# EAGLE design main controler (EAGLE 9.5.2)
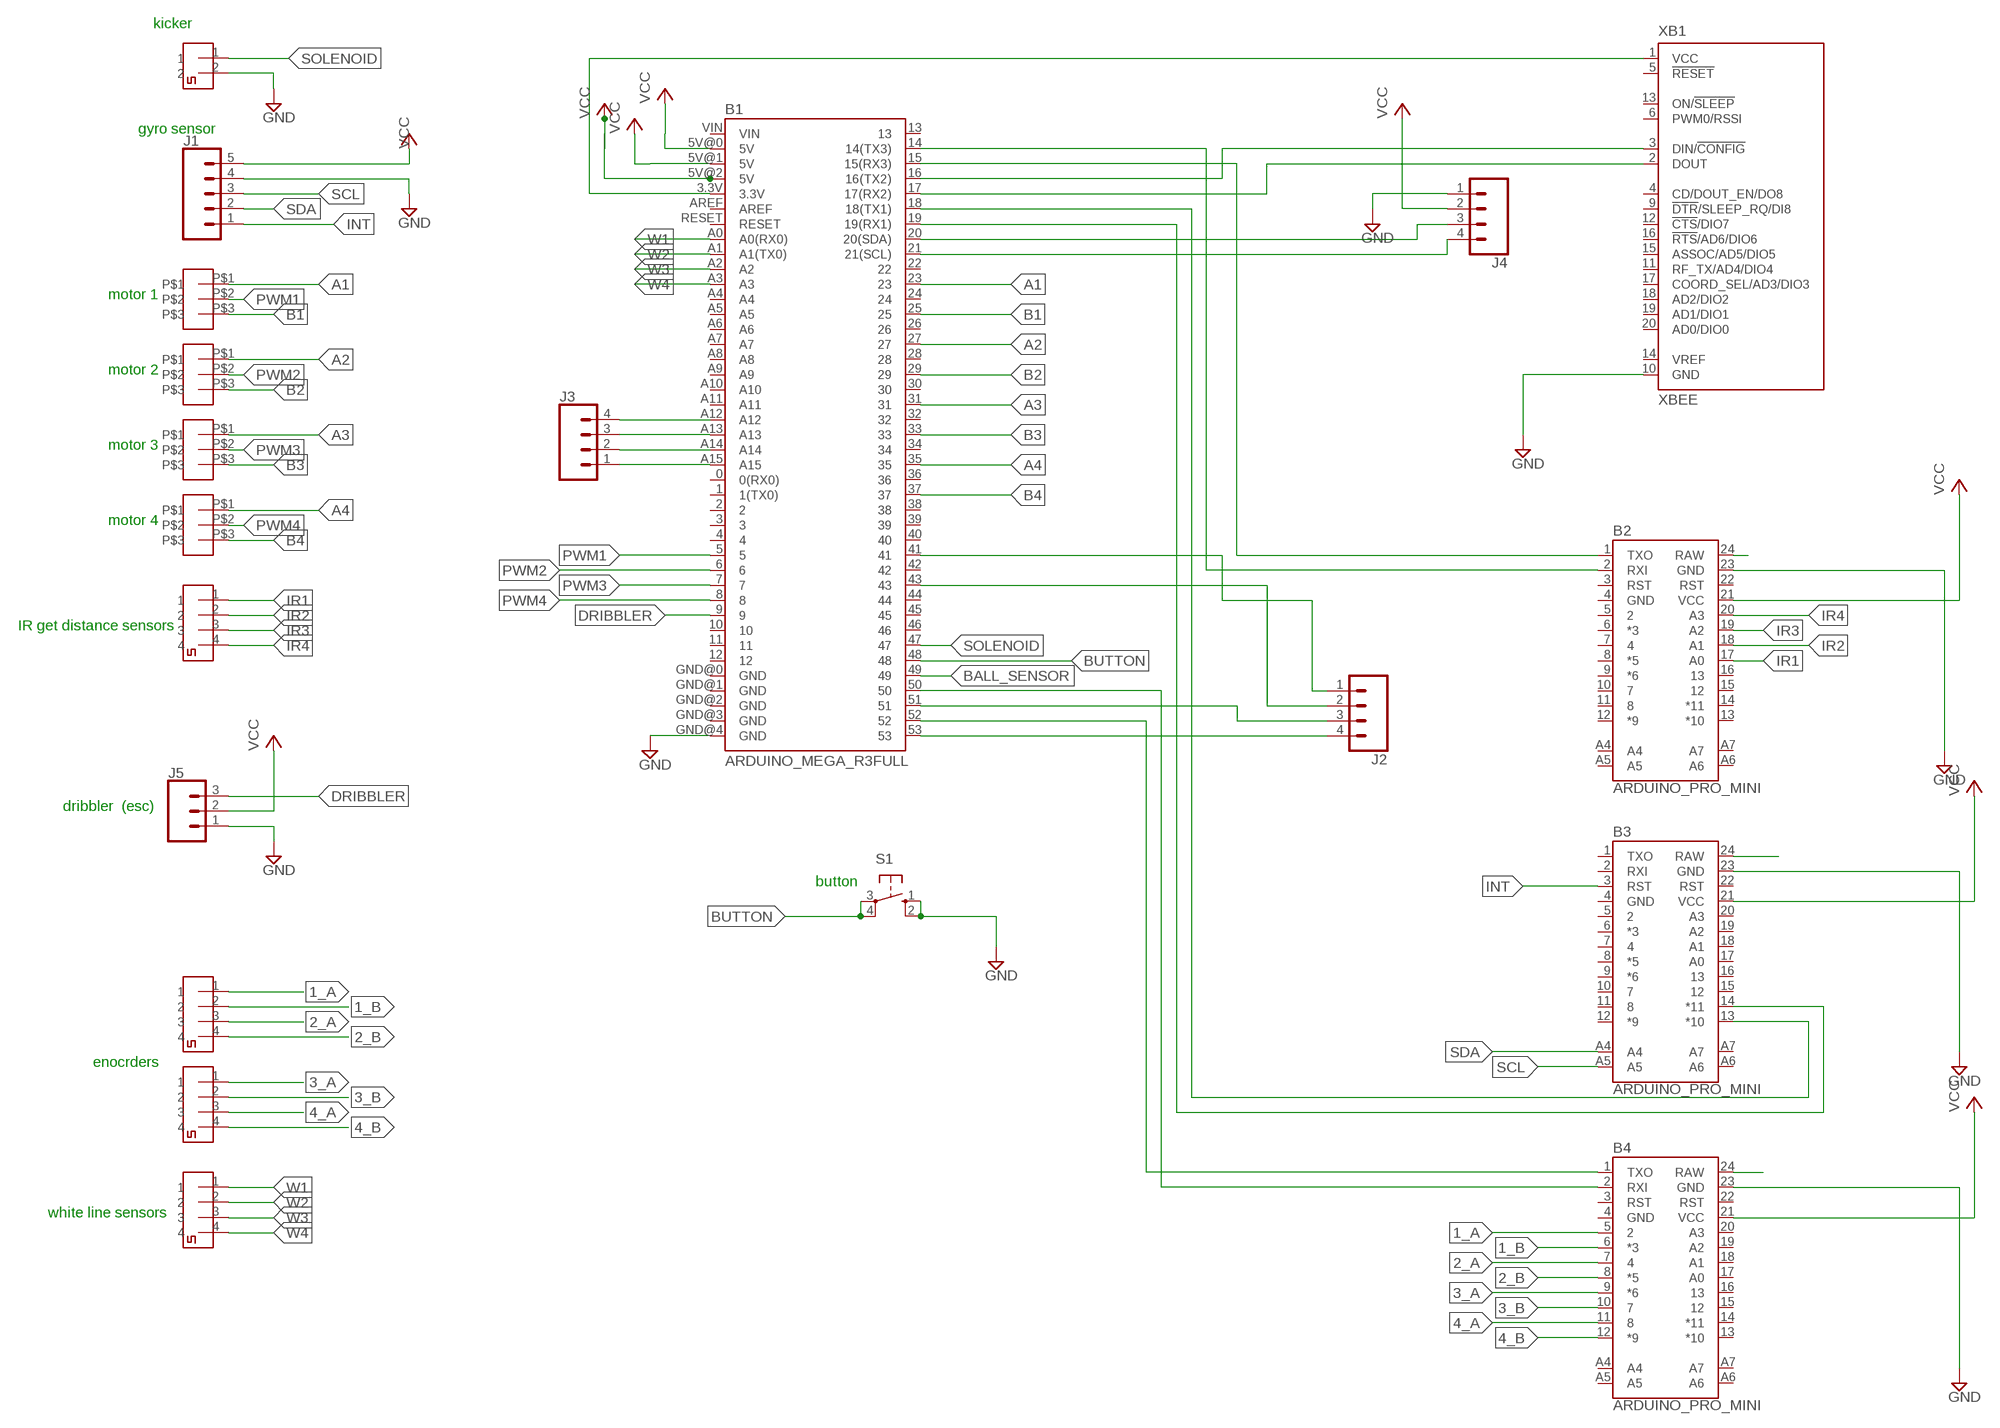
[diagram p0: schematic, sheet 1]

## Parts
B1  ARDUINO_MEGA_R3FULL  [ARDUINO_MEGA]
B2  ARDUINO_PRO_MINI  [ARDUINO_PRO_MINI]
B3  ARDUINO_PRO_MINI  [ARDUINO_PRO_MINI]
B4  ARDUINO_PRO_MINI  [ARDUINO_PRO_MINI]
CONNECTOR1  2PIN  [2PIN]
ENCODER1  2PIN  [2PIN]
ENCODER2  2PIN  [2PIN]
ENCODER3  2PIN  [2PIN]
ENCODER4  2PIN  [2PIN]
J1  CONN_05  [1X05]
J2  CONN_04  [1X04]
J3  CONN_04  [1X04]
J4  CONN_04  [1X04]
J5  CONN_03  [1X03]
MOTOR1  3PIN  [3PIN]
MOTOR2  3PIN  [3PIN]
MOTOR3  3PIN  [3PIN]
MOTOR4  3PIN  [3PIN]
S1  10-XX  [B3F-10XX]
XB1  XBEE  [XBEE]

## Nets
1_A: B4.5 ENCODER2.1
1_B: B4.6(*3) ENCODER2.2
2_A: B4.7 ENCODER2.3
2_B: B4.8(*5) ENCODER2.4
3_A: B4.9(*6) ENCODER1.1
3_B: B4.10 ENCODER1.2
4_A: B4.11 ENCODER1.3
4_B: B4.12(*9) ENCODER1.4
A1: B1.23 MOTOR1.P$1
A2: B1.27 MOTOR2.P$1
A3: B1.31 MOTOR3.P$1
A4: B1.35 MOTOR4.P$1
B1: B1.25 MOTOR1.P$3
B2: B1.29 MOTOR2.P$3
B3: B1.33 MOTOR3.P$3
B4: B1.37 MOTOR4.P$3
BALL_SENSOR: B1.49
BUTTON: B1.48 S1.3(P) S1.4(P1)
DRIBBLER: B1.9 J5.3
GND: B1.GND@4(GND) B2.23(GND) B3.23(GND) B4.23(GND) CONNECTOR1.2 J1.4 J4.1 J5.1 S1.1(S) S1.2(S1) XB1.10(GND)
INT: B3.3(RST) J1.1
IR1: B2.17(A0) ENCODER4.1
IR2: B2.18(A1) ENCODER4.2
IR3: B2.19(A2) ENCODER4.3
IR4: B2.20(A3) ENCODER4.4
N$1: B1.3.3V XB1.1(VCC)
N$2: B1.16(16(TX2)) XB1.3(DIN/!CONFIG)
N$3: B1.15(15(RX3)) B2.1(TXO)
N$4: B1.14(14(TX3)) B2.2(RXI)
N$5: B1.17(17(RX2)) XB1.2(DOUT)
N$6: B1.19(19(RX1)) B3.14(*11)
N$7: B1.18(18(TX1)) B3.13(*10)
N$8: B1.50 B4.2(RXI)
N$9: B1.52 B4.1(TXO)
N$10: B2.24(RAW)
N$11: B3.24(RAW)
N$12: B4.24(RAW)
N$13: B1.43 J2.2
N$14: B1.51 J2.3
N$15: B1.53 J2.4
N$16: B1.41 J2.1
N$17: B1.A15 J3.1
N$18: B1.A14 J3.2
N$19: B1.A13 J3.3
N$20: B1.A12 J3.4
N$22: B1.21(21(SCL)) J4.4
N$23: B1.20(20(SDA)) J4.3
PWM1: B1.5 MOTOR1.P$2
PWM2: B1.6 MOTOR2.P$2
PWM3: B1.7 MOTOR3.P$2
PWM4: B1.8 MOTOR4.P$2
SCL: B3.A5 J1.3
SDA: B3.A4 J1.2
SOLENOID: B1.47 CONNECTOR1.1
VCC: B1.5V@0(5V) B1.5V@1(5V) B1.5V@2(5V) B2.21(VCC) B3.21(VCC) B4.21(VCC) J1.5 J4.2 J5.2
W1: B1.A0(A0(RX0)) ENCODER3.1
W2: B1.A1(A1(TX0)) ENCODER3.2
W3: B1.A2 ENCODER3.3
W4: B1.A3 ENCODER3.4
Unconnected: B1.0(0(RX0)) B1.1(1(TX0)) B1.2 B1.3 B1.4 B1.10 B1.11 B1.12 B1.13 B1.22 B1.24 B1.26 B1.28 B1.30 B1.32 B1.34 B1.36 B1.38 B1.39 B1.40 B1.42 B1.44 B1.45 B1.46 B1.A4 B1.A5 B1.A6 B1.A7 B1.A8 B1.A9 B1.A10 B1.A11 B1.AREF B1.GND@0(GND) B1.GND@1(GND) B1.GND@2(GND) B1.GND@3(GND) B1.RESET B1.VIN B2.3(RST) B2.5 B2.6(*3) B2.7 B2.8(*5) B2.9(*6) B2.10 B2.11 B2.12(*9) B2.13(*10) B2.14(*11) B2.15 B2.16 B2.22(RST) B2.A4 B2.A5 B2.A6 B2.A7 B3.1(TXO) B3.2(RXI) B3.5 B3.6(*3) B3.7 B3.8(*5) B3.9(*6) B3.10 B3.11 B3.12(*9) B3.15 B3.16 B3.17(A0) B3.18(A1) B3.19(A2) B3.20(A3) B3.22(RST) B3.A6 B3.A7 B4.3(RST) B4.13(*10) B4.14(*11) B4.15 B4.16 B4.17(A0) B4.18(A1) B4.19(A2) B4.20(A3) B4.22(RST) B4.A4 B4.A5 B4.A6 B4.A7 XB1.4(CD/DOUT_EN/DO8) XB1.5(!RESET) XB1.6(PWM0/RSSI) XB1.9(!DTR!/SLEEP_RQ/DI8) XB1.11(RF_TX/AD4/DIO4) XB1.12(!CTS!/DIO7) XB1.13(ON/!SLEEP) XB1.14(VREF) XB1.15(ASSOC/AD5/DIO5) XB1.16(!RTS!/AD6/DIO6) XB1.17(COORD_SEL/AD3/DIO3) XB1.18(AD2/DIO2) XB1.19(AD1/DIO1) XB1.20(AD0/DIO0)

## Notes on the sheet
- kicker
- gyro sensor
- motor 1
- motor 2
- motor 3
- motor 4
- IR get distance sensors
- dribbler  (esc)
- button
- enocrders
- white line sensors

## Power pins joined to a net without a drawn wire
GND: B2.4(GND) B3.4(GND) B4.4(GND)

## Library data of the parts
B1 = Arduino:ARDUINO_MEGA_R3: Arduino Mega R3 ATmega2560 R3 compatible footprint. SparkFun Products: Arduino Mega 2560 R3 <https://www.sparkfun.com/products/11061>
B2-B4 = Arduino:ARDUINO_PRO_MINI: SparkFun Pro Mini Pro Mini compatible footprint. Dimensions: 0.7 x 1.3" PCB Thickness: 0.8mm SparkFun Products: 3.3V/8MHz <https://www.sparkfun.com/products/11114> 5V/16MHz <https://www.sparkfun.com/products/11113>
CONNECTOR1 = 2pin_small:2PIN: 2pin
ENCODER1-ENCODER4 = 4pin_small:2PIN: 2pin
J1 = SparkFun-Connectors:CONN_05: Multi connection point. Often used as Generic Header-pin footprint for 0.1 inch spaced/style header connections On any of the 0.1 inch spaced packages, you can populate with these: Break Away Headers - Straight <https://www.sparkfun.com/products/116> (PRT-00116) Break Away Male Headers - Right Angle <https://www.sparkfun.com/products/553> (PRT-00553) Female Headers <https://www.sparkfun.com/products/115> (PRT-00115) Break Away Headers - Machine Pin <https://www.sparkfun.com/products/117> (PRT-00117) Break Away Female Headers - Swiss Machine Pin <https://www.sparkfun.com/products/743> (PRT-00743) For SCREWTERMINALS and SPRING TERMINALS visit here: Screw Terimnals on SparkFun.com <https://www.sparkfun.com/search/results?term=Screw+Terminals> (5mm/3.5mm/2.54mm spacing) This device is also useful as a general connection point to wire up your design to another part of your project. Our various solder wires solder well into these plated through hole pads. Hook-Up Wire - Assortment (Stranded, 22 AWG) <https://www.sparkfun.com/products/11375> (PRT-11375) Hook-Up Wire - Assortment (Solid Core, 22 AWG) <https://www.sparkfun.com/products/11367> (PRT-11367) View the entire wire category on our website here <https://www.sparkfun.com/categories/141> Special notes: Molex polarized connector foot print use with SKU : PRT-08231 with associated crimp pins and housings. 1MM SMD Version SKU: PRT-10208
J2-J4 = SparkFun-Connectors:CONN_04: Multi connection point. Often used as Generic Header-pin footprint for 0.1 inch spaced/style header connections On any of the 0.1 inch spaced packages, you can populate with these: Break Away Headers - Straight <https://www.sparkfun.com/products/116> (PRT-00116) Break Away Male Headers - Right Angle <https://www.sparkfun.com/products/553> (PRT-00553) Female Headers <https://www.sparkfun.com/products/115> (PRT-00115) Break Away Headers - Machine Pin <https://www.sparkfun.com/products/117> (PRT-00117) Break Away Female Headers - Swiss Machine Pin <https://www.sparkfun.com/products/743> (PRT-00743) For SCREWTERMINALS and SPRING TERMINALS visit here: Screw Terimnals on SparkFun.com <https://www.sparkfun.com/search/results?term=Screw+Terminals> (5mm/3.5mm/2.54mm spacing) This device is also useful as a general connection point to wire up your design to another part of your project. Our various solder wires solder well into these plated through hole pads. Hook-Up Wire - Assortment (Stranded, 22 AWG) <https://www.sparkfun.com/products/11375> (PRT-11375) Hook-Up Wire - Assortment (Solid Core, 22 AWG) <https://www.sparkfun.com/products/11367> (PRT-11367) View the entire wire category on our website here <https://www.sparkfun.com/categories/141> Special notes: Molex polarized connector foot print use with SKU : PRT-08231 with associated crimp pins and housings. 1MM SMD Version SKU: PRT-10208; PROD_ID: CONN-09696
J5 = SparkFun-Connectors:CONN_03: Multi connection point. Often used as Generic Header-pin footprint for 0.1 inch spaced/style header connections On any of the 0.1 inch spaced packages, you can populate with these: Break Away Headers - Straight <https://www.sparkfun.com/products/116> (PRT-00116) Break Away Male Headers - Right Angle <https://www.sparkfun.com/products/553> (PRT-00553) Female Headers <https://www.sparkfun.com/products/115> (PRT-00115) Break Away Headers - Machine Pin <https://www.sparkfun.com/products/117> (PRT-00117) Break Away Female Headers - Swiss Machine Pin <https://www.sparkfun.com/products/743> (PRT-00743) Stackable Header - 3 Pin (Female, 0.1") <https://www.sparkfun.com/products/13875> (PRT-13875) For SCREWTERMINALS and SPRING TERMINALS visit here: Screw Terimnals on SparkFun.com <https://www.sparkfun.com/search/results?term=Screw+Terminals> (5mm/3.5mm/2.54mm spacing) This device is also useful as a general connection point to wire up your design to another part of your project. Our various solder wires solder well into these plated through hole pads. Hook-Up Wire - Assortment (Stranded, 22 AWG) <https://www.sparkfun.com/products/11375> (PRT-11375) Hook-Up Wire - Assortment (Solid Core, 22 AWG) <https://www.sparkfun.com/products/11367> (PRT-11367) View the entire wire category on our website here <https://www.sparkfun.com/categories/141> Special notes: Molex polarized connector foot print use with SKU : PRT-08232 with associated crimp pins and housings.
MOTOR1-MOTOR4 = 3PIN_2:3PIN
S1 = DC_LOAD_AU:10-XX: OMRON SWITCH; MPN: B3F-1000; OC_FARNELL: 176432; OC_NEWARK: 36M3542
XB1 = maxstream:XBEE: XBee (TM) /XBee-PRO(TM) OEM RF Modules Source: MaxStream, Inc. xbee_productmanual.pdf; MPN: XBP24-Z7UIT-004; OC_FARNELL: 1751799; OC_NEWARK: 34R5507

## Board
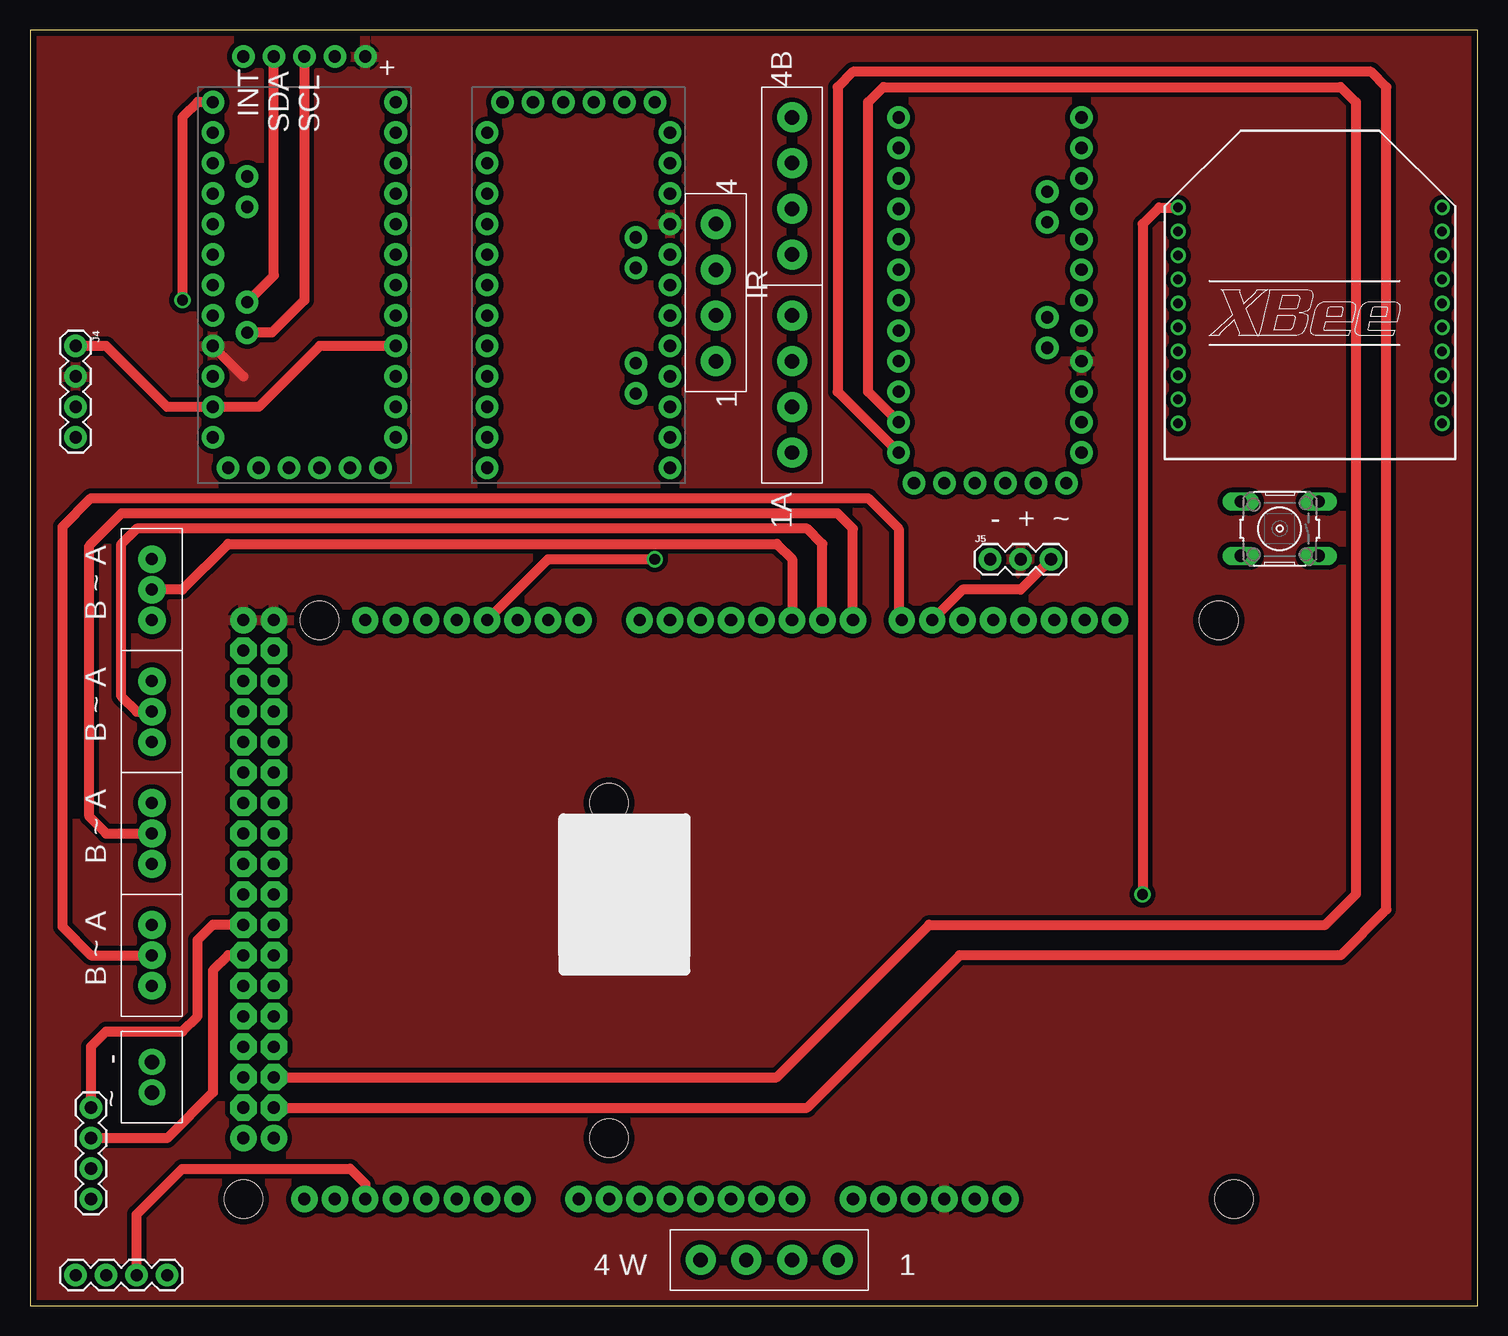
[diagram p1: board, top side]
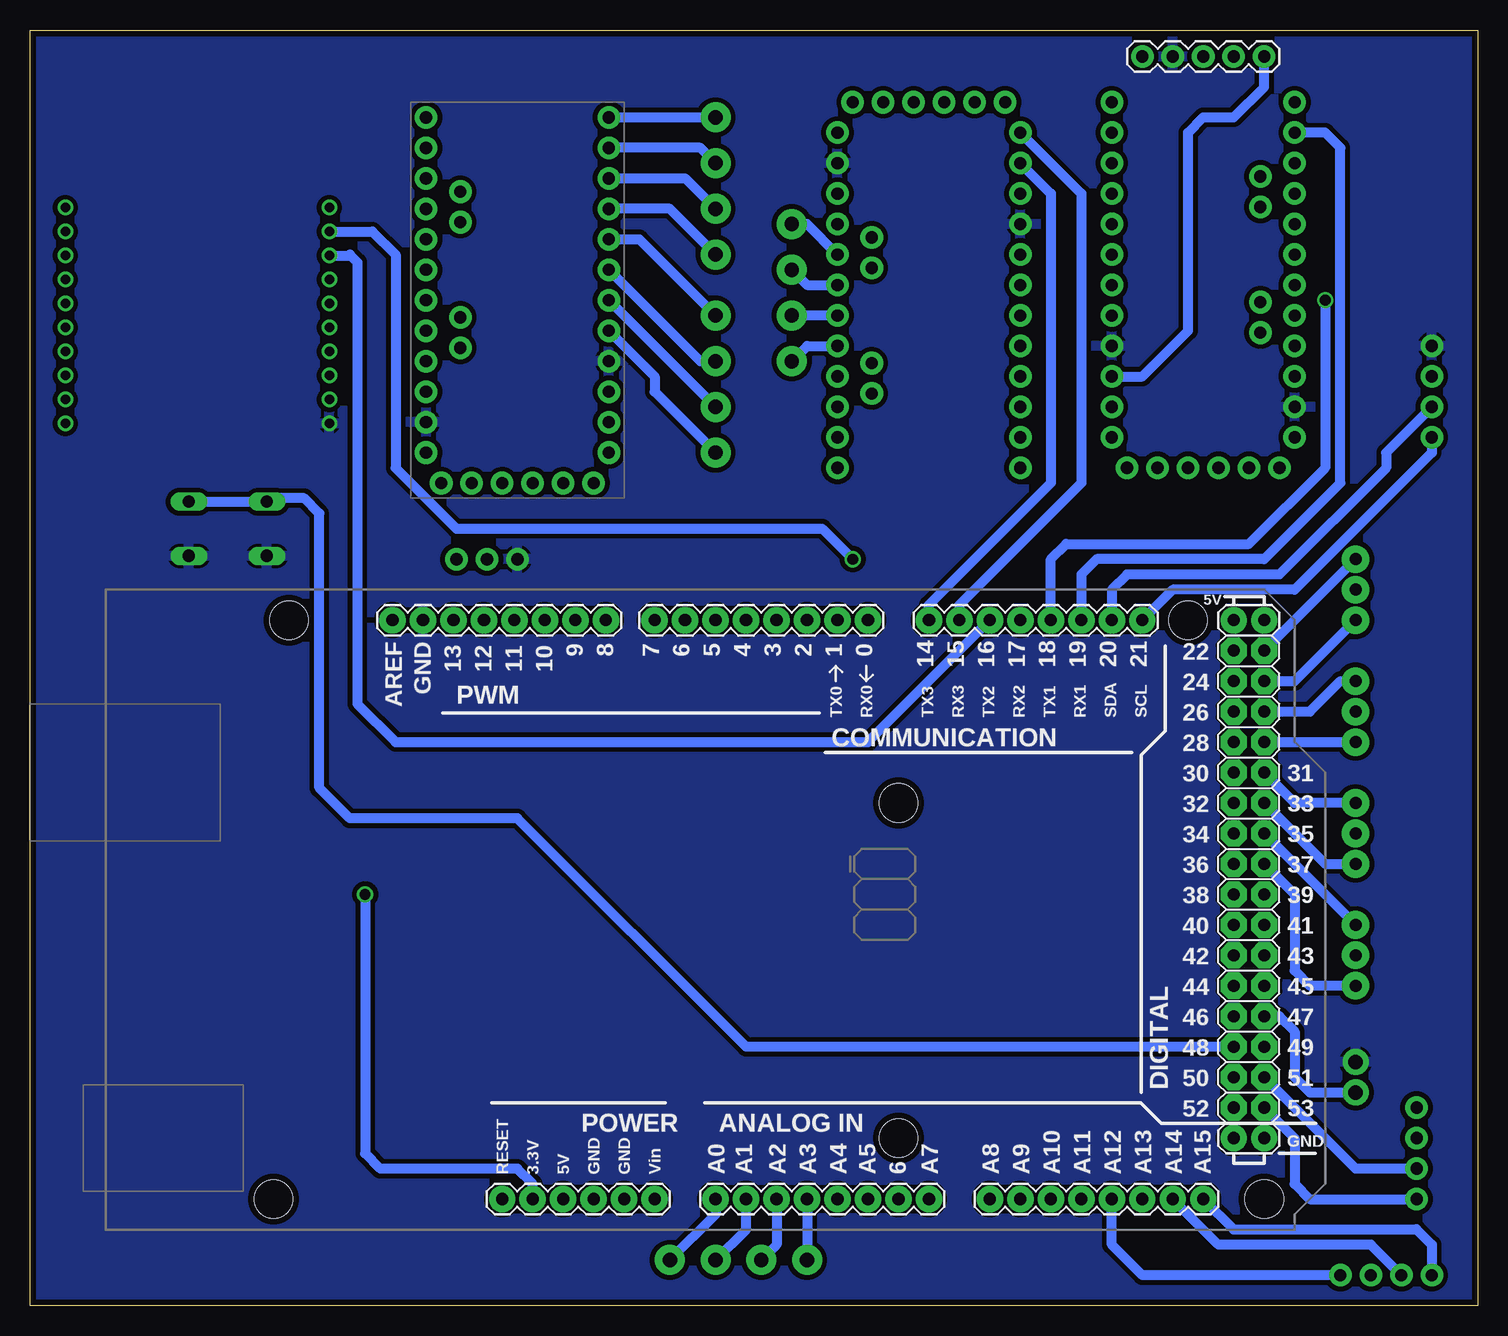
[diagram p2: board, bottom side, seen from below]

Size 120.63 x 106.35 mm. Coordinates in mm from the lower left corner, seen from the top.
Outline: 0,0 120.63,0 120.63,106.35 0,106.35 0,0
Copper layers (1*16): Top 0.035mm / dielectric 1.6mm / Bottom 0.035mm
Design rules "Elecrow_2-layer_PCB_eagle_rule": minimum track width 6mil, minimum drill 12mil, track to track 6mil, track to pad 6mil, pad to pad 6mil, via to via 8mil, smd to smd 0mil, copper to edge 20mil, drill to drill 10mil, minimum pad ring 6mil, minimum via ring 6mil, stop-mask expansion 0mil, vias tented up to drill 100mil, thermal gap 10mil

### Footprints (pad centres in the part's own frame; a part is rotated, then mirrored left to right if it is on the bottom)
ARDUINO_MEGA = drill 1.016 pad 2.2: 0 13.97,24.13; 1 11.43,24.13; 2 8.89,24.13; 3 6.35,24.13; 3.3V -13.97,-24.13; 4 3.81,24.13; 5 1.27,24.13; 5V@0 -11.43,-24.13; 5V@1 44.45,24.13; 5V@2 46.99,24.13; 6 -1.27,24.13; 7 -3.81,24.13; 8 -7.874,24.13; 9 -10.414,24.13; 10 -12.954,24.13; 11 -15.494,24.13; 12 -18.034,24.13; 13 -20.574,24.13; 14 19.05,24.13; 15 21.59,24.13; 16 24.13,24.13; 17 26.67,24.13; 18 29.21,24.13; 19 31.75,24.13; 20 34.29,24.13; 21 36.83,24.13; A0 1.27,-24.13; A1 3.81,-24.13; A2 6.35,-24.13; A3 8.89,-24.13; A4 11.43,-24.13; A5 13.97,-24.13; A6 16.51,-24.13; A7 19.05,-24.13; A8 24.13,-24.13; A9 26.67,-24.13; A10 29.21,-24.13; A11 31.75,-24.13; A12 34.29,-24.13; A13 36.83,-24.13; A14 39.37,-24.13; A15 41.91,-24.13; AREF -25.654,24.13; GND@0 -8.89,-24.13; GND@1 -6.35,-24.13; GND@2 44.45,-19.05; GND@3 46.99,-19.05; GND@4 -23.114,24.13; RESET -16.51,-24.13; VIN -3.81,-24.13 | drill 1.016 pad 2.2 octagon: 22 44.45,21.59; 23 46.99,21.59; 24 44.45,19.05; 25 46.99,19.05; 26 44.45,16.51; 27 46.99,16.51; 28 44.45,13.97; 29 46.99,13.97; 30 44.45,11.43; 31 46.99,11.43; 32 44.45,8.89; 33 46.99,8.89; 34 44.45,6.35; 35 46.99,6.35; 36 44.45,3.81; 37 46.99,3.81; 38 44.45,1.27; 39 46.99,1.27; 40 44.45,-1.27; 41 46.99,-1.27; 42 44.45,-3.81; 43 46.99,-3.81; 44 44.45,-6.35; 45 46.99,-6.35; 46 44.45,-8.89; 47 46.99,-8.89; 48 44.45,-11.43; 49 46.99,-11.43; 50 44.45,-13.97; 51 46.99,-13.97; 52 44.45,-16.51; 53 46.99,-16.51 | hole 3.2: -34.29,24.13; -35.56,-24.13; 16.51,8.89; 16.51,-19.05; 40.64,24.13; 46.99,-24.13
ARDUINO_PRO_MINI = drill 1.016 pad 1.88: 1 -7.62,12.7; 2 -7.62,10.16; 3 -7.62,7.62; 4 -7.62,5.08; 5 -7.62,2.54; 6 -7.62,0; 7 -7.62,-2.54; 8 -7.62,-5.08; 9 -7.62,-7.62; 10 -7.62,-10.16; 11 -7.62,-12.7; 12 -7.62,-15.24; 13 7.62,-15.24; 14 7.62,-12.7; 15 7.62,-10.16; 16 7.62,-7.62; 17 7.62,-5.08; 18 7.62,-2.54; 19 7.62,0; 20 7.62,2.54; 21 7.62,5.08; 22 7.62,7.62; 23 7.62,10.16; 24 7.62,12.7; A4 4.763,1.429; A5 4.763,3.969; A6 4.763,-9.049; A7 4.763,-6.509; BLK -6.35,15.24; GND -3.81,15.24; GRN 6.35,15.24; RXI 1.27,15.24; TXO 3.81,15.24; VCC -1.27,15.24
2PIN = drill 1.2 pad 2.184: 1 0,0; 2 2.54,0
2PIN' = drill 1.2 pad 2.5: 1 0,0; 2 3.81,0; 3 7.62,0; 4 11.43,0
1X05 = drill 1.016 pad 1.88: 1 0,0; 2 2.54,0; 3 5.08,0; 4 7.62,0; 5 10.16,0
1X04 = drill 1.016 pad 1.88: 1 0,0; 2 2.54,0; 3 5.08,0; 4 7.62,0
1X03 = drill 1.016 pad 1.88: 1 0,0; 2 2.54,0; 3 5.08,0
3PIN = drill 1 pad 2.3: P$1 0,0; P$2 2.54,0; P$3 5.08,0
B3F-10XX = drill 1.016 long: 1 -3.251,2.261; 2 3.251,2.261; 3 -3.251,-2.261; 4 3.251,-2.261
XBEE = drill 0.8 pad 1.27: 1 -11,9; 2 -11,7; 3 -11,5; 4 -11,3; 5 -11,1; 6 -11,-1; 7 -11,-3; 8 -11,-5; 9 -11,-7; 10 -11,-9; 11 11,-9; 12 11,-7; 13 11,-5; 14 11,-3; 15 11,-1; 16 11,1; 17 11,3; 18 11,5; 19 11,7; 20 11,9

### Placement (x,y rotation side)
B1  64.77,33.02 0 bottom
B2  45.72,85.09 0 top
B3  22.86,85.09 180 top
B4  80.01,83.82 180 bottom
CONNECTOR1  10.16,17.78 90 top
ENCODER1  2PIN  [2PIN']  63.5,87.63 90 top
ENCODER2  2PIN  [2PIN']  63.5,71.12 90 top
ENCODER3  2PIN  [2PIN']  67.31,3.81 180 top
ENCODER4  2PIN  [2PIN']  57.15,78.74 90 top
J1  17.78,104.14 180 bottom
J2  5.08,16.51 270 top
J3  3.81,2.54 0 top
J4  3.81,80.01 270 top
J5  80.01,62.23 0 top
MOTOR1  10.16,62.23 270 top
MOTOR2  10.16,52.07 270 top
MOTOR3  10.16,41.91 270 top
MOTOR4  10.16,31.75 270 top
S1  104.14,64.77 180 top
XB1  106.68,82.55 0 top

### Tracks (layer width: path | path; a pad name or v marks a point on that pad's centre or on a via)
1_A
  Bottom 0.813: B4.5 68.58,77.47 68.58,76.2 ENCODER2.1
1_B
  Bottom 0.813: B4.6 ENCODER2.2
2_A
  Bottom 0.813: ENCODER2.3 64.77,78.74 B4.7
2_B
  Bottom 0.813: B4.8 69.85,88.9 ENCODER2.4
3_A
  Bottom 0.813: ENCODER1.1 67.31,91.44 B4.9
3_B
  Bottom 0.813: B4.10 66.04,93.98 ENCODER1.2
4_A
  Bottom 0.813: ENCODER1.3 64.77,96.52 B4.11
4_B
  Bottom 0.813: B4.12 ENCODER1.4
A1
  Bottom 0.813: MOTOR1.P$1 B1.23
A2
  Bottom 0.813: B1.27 13.97,49.53 11.43,52.07 MOTOR2.P$1
A3
  Bottom 0.813: MOTOR3.P$1 15.24,41.91 B1.31
A4
  Bottom 0.813: MOTOR4.P$1 B1.35
B1
  Bottom 0.813: B1.25 15.24,52.07 MOTOR1.P$3
B2
  Bottom 0.813: B1.29 MOTOR2.P$3
B3
  Bottom 0.813: MOTOR3.P$3 12.7,36.83 B1.33
B4
  Bottom 0.813: B1.37 15.24,34.29 15.24,27.94 13.97,26.67 MOTOR4.P$3
BUTTON
  Bottom 0.813: B1.48 60.96,21.59 80.01,40.64 93.98,40.64 96.52,43.18 96.52,66.04 97.79,67.31 100.61,67.31 S1.4 S1.3
DRIBBLER
  Top 0.813: B1.9 77.72,59.69 82.55,59.69 J5.3
GND
  Top 0.813: B3.4 24.13,80.01 19.05,74.93 B3.23 11.43,74.93 6.35,80.01 J4.1
  pour Bottom (isolate 0.406): 0,106.68 0,0 121.92,0 121.92,106.68
INT
  Bottom 0.813: B3.3 27.94,77.47 24.13,81.28 24.13,97.79 22.86,99.06 20.32,99.06 17.78,101.6 J1.1
IR1
  Bottom 0.813: ENCODER4.1 55.88,80.01 B2.17
IR2
  Bottom 0.813: B2.18 ENCODER4.2
IR3
  Bottom 0.813: ENCODER4.3 55.88,85.09 B2.19
IR4
  Bottom 0.813: ENCODER4.4 55.88,90.17 B2.20
N$1  (via drill 0.9)
  Top 0.813: v92.71,34.29 92.71,90.17 94.09,91.55 XB1.1
  Bottom 0.813: v92.71,34.29 92.71,12.7 91.44,11.43 80.01,11.43 78.74,10.16 B1.3.3V
N$2
  Bottom 0.813: B1.16 50.8,46.99 90.17,46.99 93.34,50.16 93.34,87 93.98,87.63 94.06,87.55 XB1.3
N$3
  Bottom 0.813: B2.1 33.02,92.71 33.02,68.58 43.18,58.42 B1.15
N$4
  Bottom 0.813: B2.2 35.56,92.71 35.56,68.58 45.72,58.42 B1.14
N$5  (via drill 0.9)
  Top 0.813: B1.17 43.18,62.23 v52.07,62.23
  Bottom 0.813: v52.07,62.23 54.61,64.77 85.09,64.77 90.17,69.85 90.17,87.63 92.09,89.55 XB1.2
N$6
  Bottom 0.813: B3.14 12.7,97.79 11.43,96.52 11.43,68.58 17.78,62.23 31.75,62.23 33.02,60.96 B1.19
N$7  (via drill 0.9)
  Top 0.813: B3.13 13.97,100.33 12.7,99.06 v12.7,83.82
  Bottom 0.813: v12.7,83.82 12.7,69.85 19.05,63.5 34.29,63.5 35.56,62.23 B1.18
N$8
  Top 0.813: B4.2 69.85,76.2 69.85,100.33 71.12,101.6 109.22,101.6 110.49,100.33 110.49,34.29 107.95,31.75 74.93,31.75 62.23,19.05 B1.50
N$9
  Top 0.813: B4.1 67.31,76.2 67.31,101.6 68.58,102.87 111.76,102.87 113.03,101.6 113.03,33.02 109.22,29.21 77.47,29.21 64.77,16.51 B1.52
N$13
  Top 0.813: B1.43 16.51,29.21 15.24,27.94 15.24,17.78 11.43,13.97 J2.2
N$14
  Bottom 0.813: J2.3 10.16,11.43 B1.51
N$15
  Bottom 0.813: B1.53 15.24,13.97 15.24,10.16 13.97,8.89 J2.4
N$16
  Top 0.813: B1.41 15.24,31.75 13.97,30.48 13.97,24.13 12.7,22.86 6.35,22.86 5.08,21.59 J2.1
N$17
  Bottom 0.813: B1.A15 20.32,6.35 20.32,6.38 5.11,6.38 3.81,5.08 J3.1
N$18
  Bottom 0.813: J3.2 8.89,5.08 21.59,5.08 B1.A14
N$19
  Top 0.813: J3.3 8.89,7.62 12.67,11.4 26.67,11.4 26.67,11.43 27.94,10.16 B1.A13
N$20
  Bottom 0.813: J3.4 27.94,2.54 30.48,5.08 B1.A12
N$22
  Bottom 0.813: B1.21 25.4,59.69 15.24,59.69 3.81,71.12 J4.4
N$23
  Bottom 0.813: J4.3 7.62,71.12 7.62,69.85 16.51,60.96 29.21,60.96 30.48,59.69 B1.20
PWM1
  Top 0.813: MOTOR1.P$2 12.7,59.69 16.51,63.5 62.23,63.5 63.5,62.23 B1.5
PWM2
  Top 0.813: MOTOR2.P$2 8.89,49.53 7.62,50.8 7.62,63.5 8.89,64.77 64.77,64.77 66.04,63.5 B1.6
PWM3
  Top 0.813: MOTOR3.P$2 6.35,39.37 4.95,40.77 4.95,63.37 7.62,66.04 67.31,66.04 68.58,64.77 B1.7
PWM4
  Top 0.813: B1.8 72.39,57.15 72.39,64.77 69.85,67.31 5.08,67.31 2.71,64.94 2.71,31.58 5.08,29.21 MOTOR4.P$2
SCL
  Top 0.813: B3.A5 20.16,81.12 22.86,83.82 J1.3
SDA
  Top 0.813: B3.A4 20.32,85.88 J1.2
SOLENOID
  Bottom 0.813: B1.47 16.51,24.13 15.24,22.86 15.24,19.05 13.97,17.78 CONNECTOR1.1
VCC
  Top 0.813: B3.21 17.78,77.47
  pour Top (isolate 0.406): 0,106.68 0,0 121.92,0 121.92,106.68
W1
  Bottom 0.813: B1.A0 63.5,7.62 ENCODER3.1
W2
  Bottom 0.813: ENCODER3.2 60.96,6.35 B1.A1
W3
  Bottom 0.813: ENCODER3.3 58.42,5.08 B1.A2
W4
  Bottom 0.813: B1.A3 ENCODER3.4

### Text on the board
tNames: + | 4B | INT | SDA | SCL | 4 | IR | 1 | 1A | - + ~ | B ~ A | B ~ A | B ~ A | B ~ A | ~ - | 4 W | 1